# Altium schematic sheet CANSwitch_V2.SchDoc
size A4; SheetNumber: 1; SheetTotal: 3
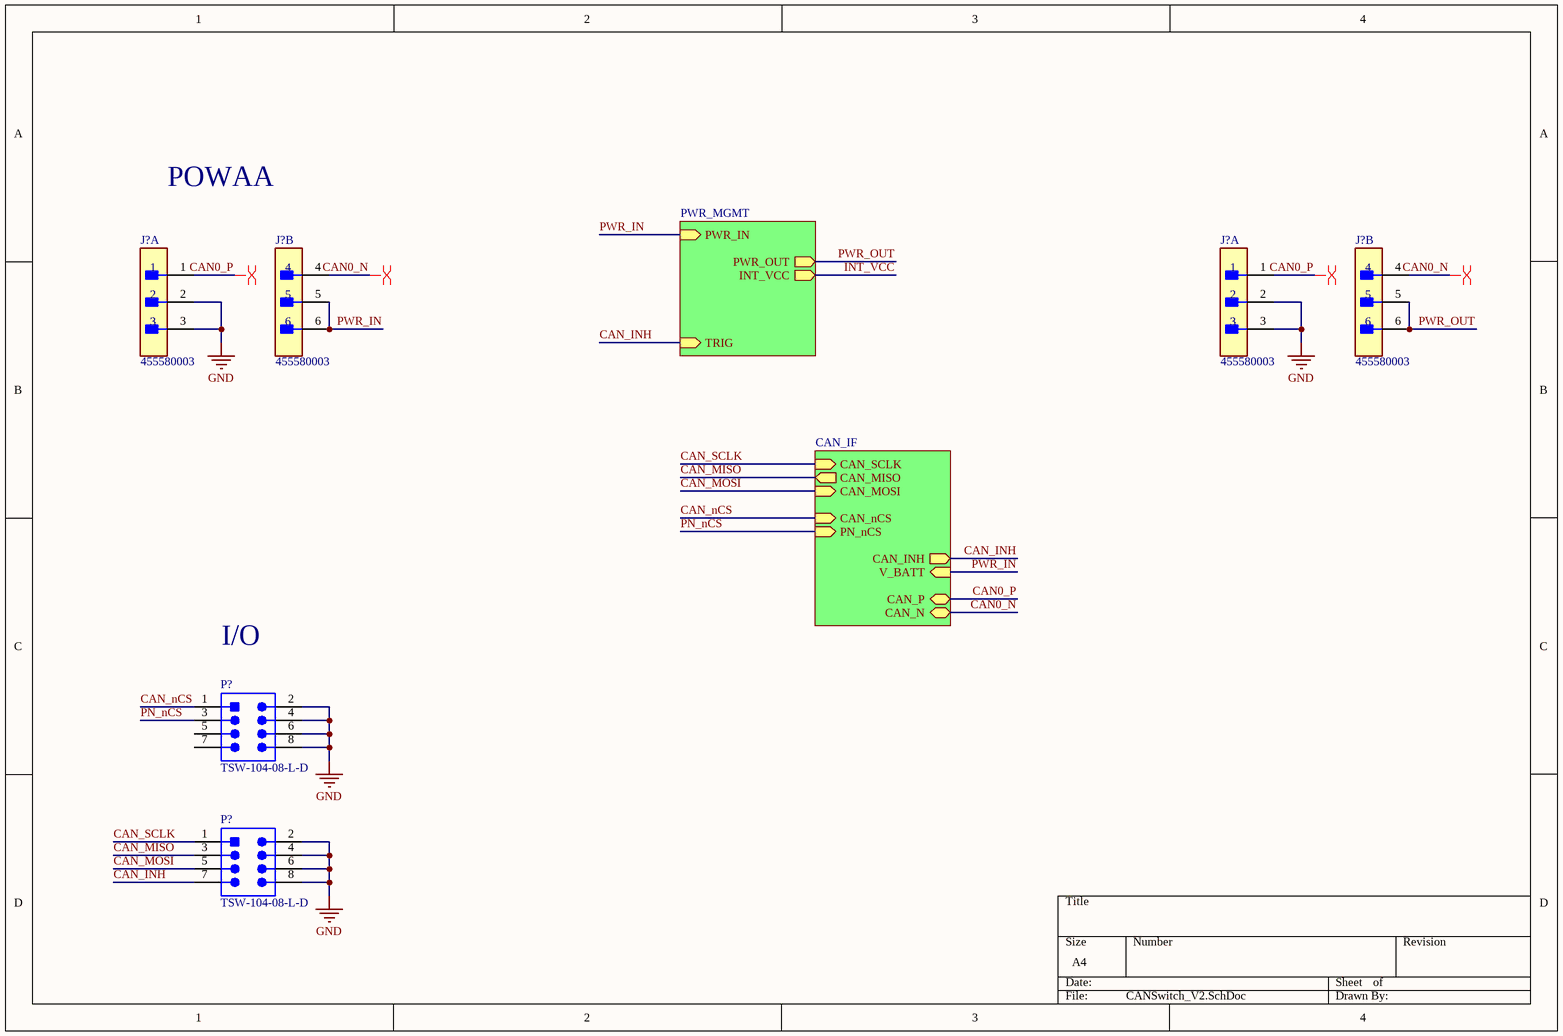
[diagram p0: CANSwitch_V2.SchDoc]

## Parts
(Parts that share a designator on the sheet are numbered #1, #2 ... from top to bottom, then left to right.)
J?#1  455580003  [FP-455580003-MFG]  (part A of 2)
J?#2  455580003  [FP-455580003-MFG]  (part B of 2)
J?#3  455580003  [FP-455580003-MFG]  (part A of 2)
J?#4  455580003  [FP-455580003-MFG]  (part B of 2)
P?#1  TSW-104-08-L-D  [SMTC-TSW-104-08-L-D_V]
P?#2  TSW-104-08-L-D  [SMTC-TSW-104-08-L-D_V]

## Sub-sheets
CAN_0 = CAN_IF: CAN_SCLK (in), CAN_MISO (out), CAN_MOSI (in), CAN_nCS (in), CAN_INH (out), V_BATT (in), CAN_P (bidir), CAN_N (bidir), PN_nCS (in)
PWR_MGMT = PWR_MGMT: TRIG (in), PWR_OUT (out), PWR_IN (in), INT_VCC (out)

## Nets
GND: J?#1.2 J?#1.3 J?#3.2 J?#3.3 P?#1.2 P?#1.4 P?#1.6 P?#1.8 P?#2.2 P?#2.4 P?#2.6 P?#2.8
CAN0_N: J?#2.4 J?#4.4 ; sheet CAN_0/CAN_N
CAN0_P: J?#1.1 J?#3.1 ; sheet CAN_0/CAN_P
CAN_INH: P?#2.7 ; sheet CAN_0/CAN_INH, sheet PWR_MGMT/TRIG
CAN_MISO: P?#2.3 ; sheet CAN_0/CAN_MISO
CAN_MOSI: P?#2.5 ; sheet CAN_0/CAN_MOSI
CAN_nCS: P?#1.1 ; sheet CAN_0/CAN_nCS
CAN_SCLK: P?#2.1 ; sheet CAN_0/CAN_SCLK
INT_VCC: sheet PWR_MGMT/INT_VCC
PN_nCS: P?#1.3 ; sheet CAN_0/PN_nCS
PWR_IN: J?#2.5 J?#2.6 ; sheet CAN_0/V_BATT, sheet PWR_MGMT/PWR_IN
PWR_OUT: J?#4.5 J?#4.6 ; sheet PWR_MGMT/PWR_OUT

Not connected (* = marked no-connect by the designer): P?#1 5 7

## Layout directives
differential pair: CAN0_N, CAN0_P

## Notes on the sheet
- POWAA
- I/O

## Library data of the parts
J?#1-J?#4 = CMP-04776-000024-1: CONN HEADER R/A 6POS 4.2MM; Manufacturer: Molex; Standoff Height: 0.4mm; Conn Orientation: Right Angle; Number Of Contacts: 6; Conn Gender: Male; Voltage Rating: 600V; Current Rating: 8A; Footprint Url: https://www.molex.com/pdm_docs/sd/455580003_sd.pdf; Number Of Rows: 2; Lead Free: Yes; Digikey Description: CONN HEADER R/A 6POS 4.2MM; ComponentLink2URL: https://www.molex.com/webdocs/datasheets/pdf/en-us/0455580003_PCB_HEADERS.pdf; Octopart: https://octopart.com/45558-0003-molex-7672845; Package: 0; Device Class L3: unset; ComponentLink2Description: Datasheet; Device Class L2: Headers and Wire Housings; Category: Conn; Contact Material: Tin,Nickel; Mouser Description: Conn Power HDR 6 POS 4.2mm Solder ST Thru-Hole 6 Terminal 1 Port Mini-Fit Jr™ Tray; Manufacturer Part Number: 455580003; Pitch: 4.2mm; Device Class L1: Connectors; Temperature Range Low: -40°C; Temperature: -40°C to +105°C; RoHS: TRUE; Temperature Range High: +105°C; Height: 10.38mm; Automotive: No
P?#1 P?#2 = CMP-1681-00006-4: Male Header, Pitch 2.54 mm, 2 x 4 Position, Height 8.38 mm, Tail Length 5.08 mm, -55 to 125 degC, RoHS, Bulk; Manufacturer: Samtec; Voltage Rating: 550 V; Current Rating: 7.6 A; Rows: 2; ComponentLink2URL: https://datasheet.ciiva.com/25616/0900766b81154476-25616879.pdf; Package Quantity: 1; PackageDescription: Male Header, Pitch 2.54 mm, 2 x 4 Position, Height 8.38 mm, Tail Length 5.08 mm; ComponentLink1Description: Manufacturer URL; Lead Pitch: 0.1 inch; REACH SVHC: No SVHC; Mounting Technology: Through Hole; PackageReference: TSW-104-08-L-D; Contact Plating: Gold; DatasheetVersion: 04/2012; Colour: Black; Contact Finish: Gold; ComponentLink3URL: http://suddendocs.samtec.com/prints/tsw-xxx-xx-x-x-xx-xxx-footprint.pdf; ComponentLink3Description: Package Specification; Mount: Through Hole; RoHSCompliant: true; Packaging: Bulk; ComponentLink2Description: Datasheet; Contact Material: Bronze; Pins: 8; ComponentLink1URL: http://www.samtec.com/